# Altium schematic sheet AMS_Slave_Inputs.SchDoc: Sheetname
size A4; Date: 05.10.2017; CheckedBy: UNCHECKED; Author: Team Member; Organization: Baltic Racing; Address1: Zur Schwedenschanze 15; Address2: Haus 18; Address3: 18435 Stralsund; Revision: xx.xx; SheetNumber: 2; SheetTotal: 3; Rules: TODO; ProjectName: Projekt
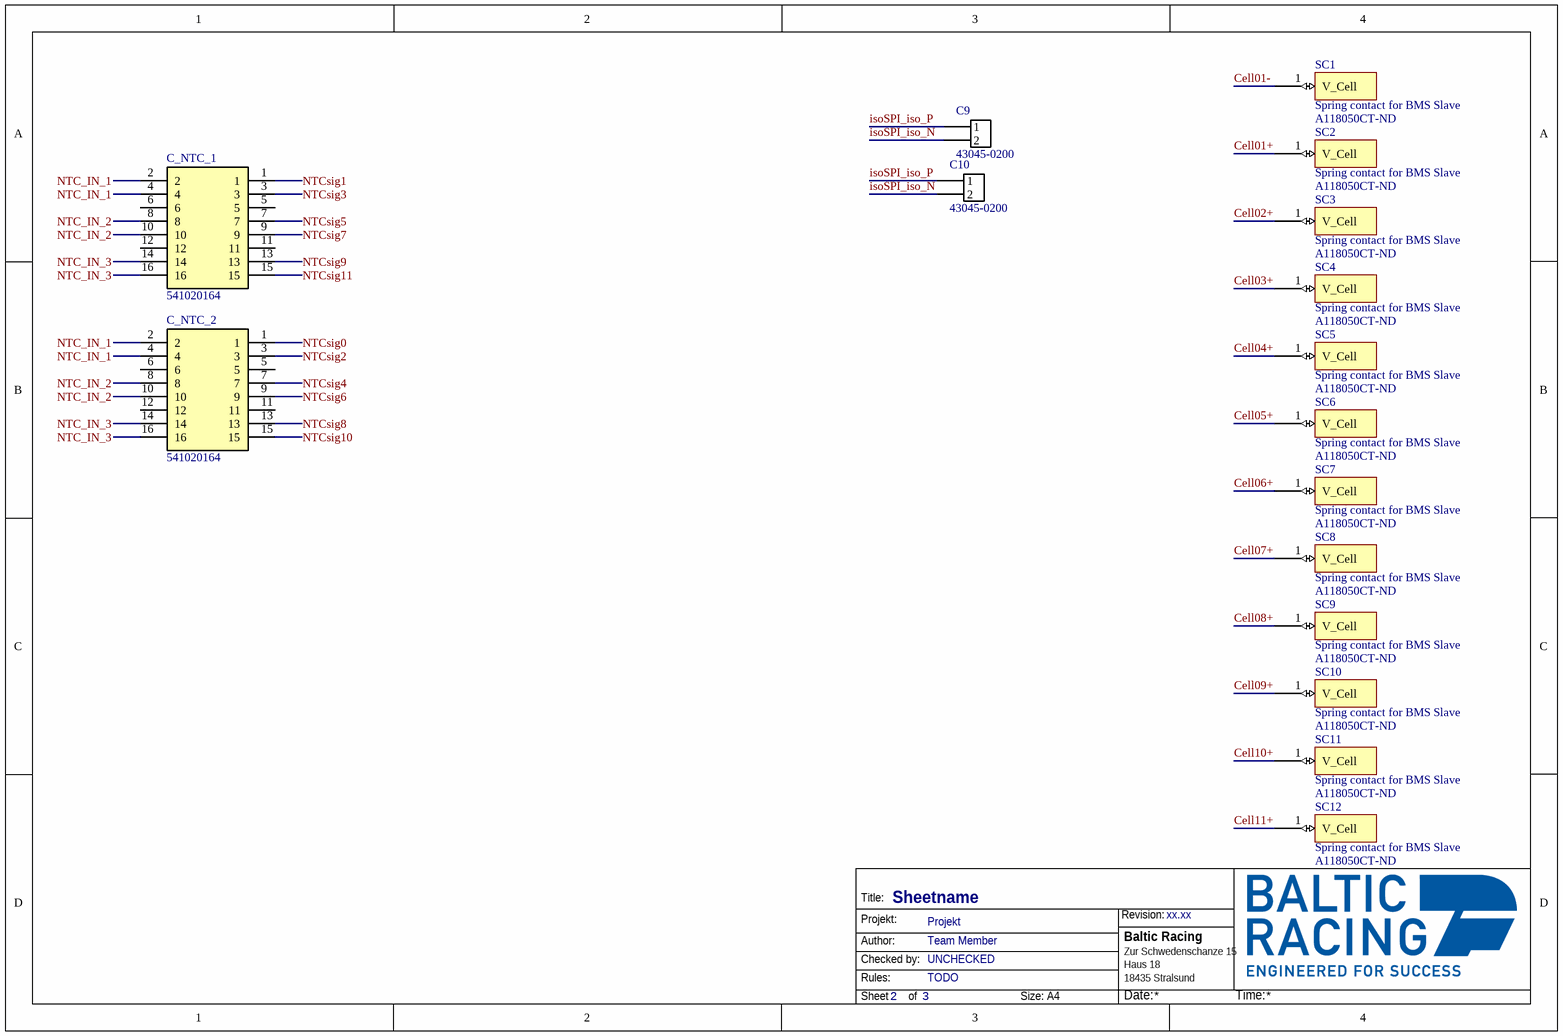
[diagram p0: AMS_Slave_Inputs.SchDoc]

## Parts
C9  43045-0200  [43650-0200]
C10  43045-0200  [43650-0200]
C_NTC_1  541020164  [541020164]
C_NTC_2  541020164  [541020164]
SC1  Spring contact for BMS Slave  Supplier Part Number 1: A118050CT-ND  [1734300-1 Spring Contact]
SC2  Spring contact for BMS Slave  Supplier Part Number 1: A118050CT-ND  [1734300-1 Spring Contact]
SC3  Spring contact for BMS Slave  Supplier Part Number 1: A118050CT-ND  [1734300-1 Spring Contact]
SC4  Spring contact for BMS Slave  Supplier Part Number 1: A118050CT-ND  [1734300-1 Spring Contact]
SC5  Spring contact for BMS Slave  Supplier Part Number 1: A118050CT-ND  [1734300-1 Spring Contact]
SC6  Spring contact for BMS Slave  Supplier Part Number 1: A118050CT-ND  [1734300-1 Spring Contact]
SC7  Spring contact for BMS Slave  Supplier Part Number 1: A118050CT-ND  [1734300-1 Spring Contact]
SC8  Spring contact for BMS Slave  Supplier Part Number 1: A118050CT-ND  [1734300-1 Spring Contact]
SC9  Spring contact for BMS Slave  Supplier Part Number 1: A118050CT-ND  [1734300-1 Spring Contact]
SC10  Spring contact for BMS Slave  Supplier Part Number 1: A118050CT-ND  [1734300-1 Spring Contact]
SC11  Spring contact for BMS Slave  Supplier Part Number 1: A118050CT-ND  [1734300-1 Spring Contact]
SC12  Spring contact for BMS Slave  Supplier Part Number 1: A118050CT-ND  [1734300-1 Spring Contact]

## Nets
Cell01+: SC2.1(V_Cell)
Cell01-: SC1.1(V_Cell)
Cell02+: SC3.1(V_Cell)
Cell03+: SC4.1(V_Cell)
Cell04+: SC5.1(V_Cell)
Cell05+: SC6.1(V_Cell)
Cell06+: SC7.1(V_Cell)
Cell07+: SC8.1(V_Cell)
Cell08+: SC9.1(V_Cell)
Cell09+: SC10.1(V_Cell)
Cell10+: SC11.1(V_Cell)
Cell11+: SC12.1(V_Cell)
isoSPI_iso_N: C9.2 C10.2
isoSPI_iso_P: C9.1 C10.1
NTC_IN_1: C_NTC_1.2 C_NTC_1.4 C_NTC_2.2 C_NTC_2.4
NTC_IN_2: C_NTC_1.8 C_NTC_1.10 C_NTC_2.8 C_NTC_2.10
NTC_IN_3: C_NTC_1.14 C_NTC_1.16 C_NTC_2.14 C_NTC_2.16
NTCsig0: C_NTC_2.1
NTCsig1: C_NTC_1.1
NTCsig2: C_NTC_2.3
NTCsig3: C_NTC_1.3
NTCsig4: C_NTC_2.7
NTCsig5: C_NTC_1.7
NTCsig6: C_NTC_2.9
NTCsig7: C_NTC_1.9
NTCsig8: C_NTC_2.13
NTCsig9: C_NTC_1.13
NTCsig10: C_NTC_2.15
NTCsig11: C_NTC_1.15

Not connected (* = marked no-connect by the designer): C_NTC_1 5 6 11 12; C_NTC_2 5 6 11 12

## Notes on the sheet
- Title:
- Projekt:
- Revision:
- Author:
- Rules:
- Checked by:
- Sheet
- of
- Size:
- A4
- Date:
- Time:

## Library data of the parts
C9 C10 = MicroFit3.0 2-Pin: Molex Micro-Fit 3.0 2-Pin / 600V / 8.5A
C_NTC_1 C_NTC_2 = 541020164: 0.50mm Pitch SlimStack Receptacle, Surface Mount, Dual Row, Vertical, 2.50mm Stacking Height, Gold Plating with Nickel Barrier, 16 Circuits
SC1-SC12 = 1734300-1: PCB Spring Contact, C-Clip, Uncompressed Height 3 mm [.118 in], Length 4.5 mm [.177 in], Width .098 in [2.5 mm]; Supplier 1: Digi-Key